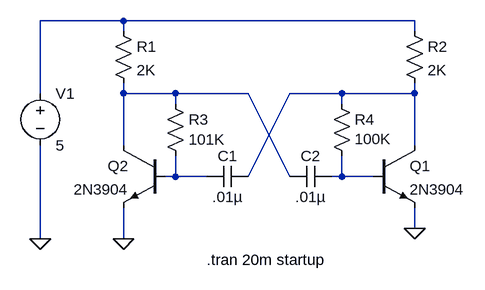
[diagram p0: schematic panes.asc]
panes.asc, the LTspice schematic file:
Version 4
SHEET 1 888 1240
WIRE -688 848 -688 736
WIRE -688 1072 -688 928
WIRE -560 736 -688 736
WIRE -560 752 -560 736
WIRE -560 848 -560 832
WIRE -560 928 -560 848
WIRE -560 1072 -560 1024
WIRE -480 848 -560 848
WIRE -480 864 -480 848
WIRE -480 976 -496 976
WIRE -480 976 -480 944
WIRE -432 976 -480 976
WIRE -368 848 -480 848
WIRE -304 848 -368 976
WIRE -304 976 -368 848
WIRE -224 848 -304 848
WIRE -224 864 -224 848
WIRE -224 976 -240 976
WIRE -224 976 -224 944
WIRE -176 976 -224 976
WIRE -112 736 -560 736
WIRE -112 752 -112 736
WIRE -112 848 -224 848
WIRE -112 848 -112 832
WIRE -112 928 -112 848
WIRE -112 1056 -112 1024
FLAG -112 1056 0
FLAG -560 1072 0
FLAG -688 1072 0
SYMBOL RES -576 736 R0
SYMATTR InstName R1
SYMATTR Value 2K
SYMBOL res -128 736 R0
SYMATTR InstName R2
SYMATTR Value 2K
SYMBOL res -496 848 R0
WINDOW 3 36 71 Left 0
SYMATTR Value 101K
SYMATTR InstName R3
SYMBOL res -240 848 R0
WINDOW 3 36 70 Left 0
SYMATTR Value 100K
SYMATTR InstName R4
SYMBOL cap -368 960 R90
WINDOW 0 0 32 VBottom 0
WINDOW 3 32 32 VTop 0
SYMATTR InstName C1
SYMATTR Value .01µ
SYMBOL cap -240 960 R90
WINDOW 0 0 32 VBottom 0
WINDOW 3 32 32 VTop 0
SYMATTR InstName C2
SYMATTR Value .01µ
SYMBOL VOLTAGE -688 832 R0
SYMATTR InstName V1
SYMATTR Value 5
SYMBOL NPN -176 928 R0
SYMATTR InstName Q1
SYMATTR Value 2N3904
SYMBOL npn -496 928 M0
SYMATTR InstName Q2
SYMATTR Value 2N3904
TEXT -432 1104 Left 0 !.tran 20m startup

The netlist it stands for:
* panes.asc
R1 N001 N002 2K
R2 N001 N004 2K
R3 N002 N003 101K
R4 N004 N005 100K
C1 N004 N003 .01µ
C2 N005 N002 .01µ
V1 N001 0 5
Q1 N004 N005 0 0 2N3904
Q2 N002 N003 0 0 2N3904
.model NPN NPN
.model PNP PNP
.lib standard.bjt
.tran 20m startup
.backanno
.end